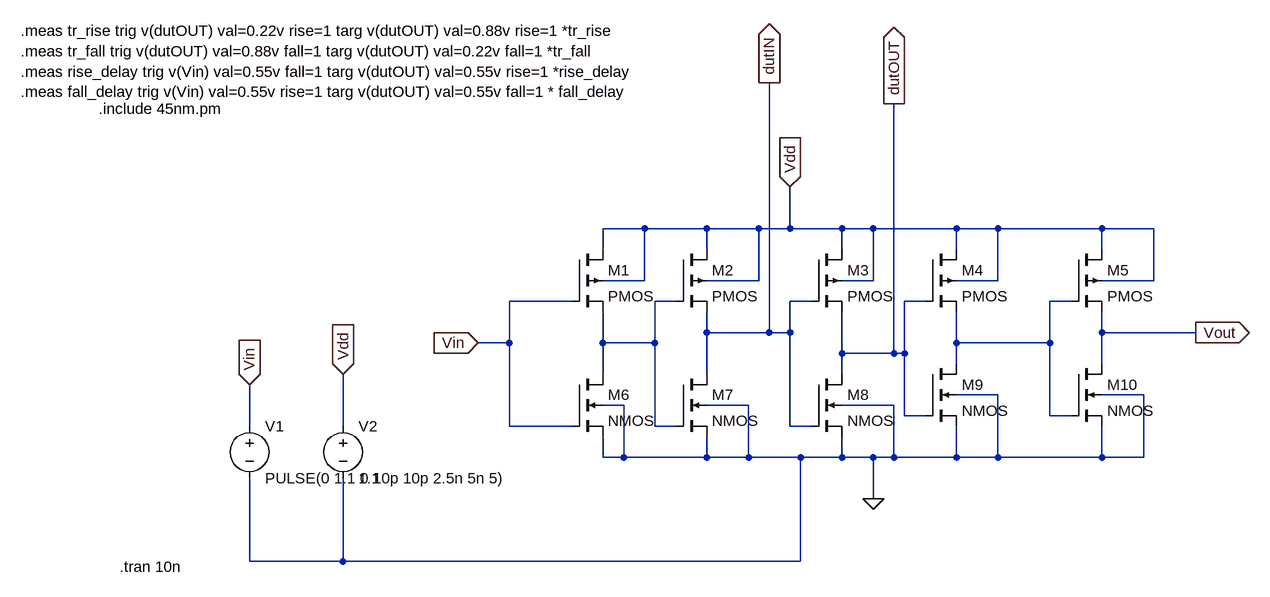
[diagram p0: schematic hw-1.asc]
hw-1.asc, the LTspice schematic file:
Version 4
SHEET 1 1280 732
WIRE 320 192 256 192
WIRE 416 192 320 192
WIRE 496 192 416 192
WIRE 544 192 544 128
WIRE 544 192 496 192
WIRE 624 192 544 192
WIRE 672 192 624 192
WIRE 800 192 672 192
WIRE 864 192 800 192
WIRE 1024 192 864 192
WIRE 1104 192 1024 192
WIRE 256 224 256 192
WIRE 416 224 416 192
WIRE 624 224 624 192
WIRE 800 224 800 192
WIRE 1024 224 1024 192
WIRE 320 272 320 192
WIRE 320 272 256 272
WIRE 496 272 496 192
WIRE 496 272 416 272
WIRE 672 272 672 192
WIRE 672 272 624 272
WIRE 864 272 864 192
WIRE 864 272 800 272
WIRE 1104 272 1104 192
WIRE 1104 272 1024 272
WIRE 208 304 112 304
WIRE 368 304 336 304
WIRE 576 304 544 304
WIRE 752 304 720 304
WIRE 976 304 944 304
WIRE 416 352 416 320
WIRE 512 352 512 -32
WIRE 512 352 416 352
WIRE 544 352 544 304
WIRE 544 352 512 352
WIRE 1024 352 1024 320
WIRE 1168 352 1024 352
WIRE 112 368 112 304
WIRE 112 368 64 368
WIRE 256 368 256 320
WIRE 336 368 336 304
WIRE 336 368 256 368
WIRE 800 368 800 320
WIRE 944 368 944 304
WIRE 944 368 800 368
WIRE 624 384 624 320
WIRE 704 384 704 0
WIRE 704 384 624 384
WIRE 720 384 720 304
WIRE 720 384 704 384
WIRE 800 400 800 368
WIRE 1024 400 1024 352
WIRE 256 416 256 368
WIRE 416 416 416 352
WIRE 624 416 624 384
WIRE 864 448 800 448
WIRE 1088 448 1024 448
WIRE 288 464 256 464
WIRE 480 464 416 464
WIRE 704 464 624 464
WIRE 720 480 720 384
WIRE 752 480 720 480
WIRE 944 480 944 368
WIRE 976 480 944 480
WIRE -288 496 -288 432
WIRE -144 496 -144 416
WIRE 112 496 112 368
WIRE 208 496 112 496
WIRE 336 496 336 368
WIRE 368 496 336 496
WIRE 544 496 544 352
WIRE 576 496 544 496
WIRE 256 544 256 512
WIRE 288 544 288 464
WIRE 288 544 256 544
WIRE 416 544 416 512
WIRE 416 544 288 544
WIRE 480 544 480 464
WIRE 480 544 416 544
WIRE 560 544 480 544
WIRE 624 544 624 512
WIRE 624 544 560 544
WIRE 672 544 624 544
WIRE 704 544 704 464
WIRE 704 544 672 544
WIRE 800 544 800 496
WIRE 800 544 704 544
WIRE 864 544 864 448
WIRE 864 544 800 544
WIRE 1024 544 1024 496
WIRE 1024 544 864 544
WIRE 1088 544 1088 448
WIRE 1088 544 1024 544
WIRE 672 608 672 544
WIRE -288 704 -288 576
WIRE -144 704 -144 576
WIRE -144 704 -288 704
WIRE 560 704 560 544
WIRE 560 704 -144 704
FLAG 544 128 Vdd
IOPIN 544 128 In
FLAG 64 368 Vin
IOPIN 64 368 In
FLAG 672 608 0
FLAG 1168 352 Vout
IOPIN 1168 352 Out
FLAG -288 432 Vin
IOPIN -288 432 In
FLAG -144 416 Vdd
IOPIN -144 416 In
FLAG 512 -32 dutIN
IOPIN 512 -32 Out
FLAG 704 0 dutOUT
IOPIN 704 0 Out
SYMBOL pmos4 208 224 R0
SYMATTR InstName M1
SYMATTR Value2 l=45n w=0.296u
SYMBOL pmos4 368 224 R0
SYMATTR InstName M2
SYMATTR Value2 l=45n w=0.296u m=4
SYMBOL pmos4 576 224 R0
SYMATTR InstName M3
SYMATTR Value2 l=45n w=0.296u m=16
SYMBOL pmos4 752 224 R0
SYMATTR InstName M4
SYMATTR Value2 l=45n w=0.296u m=64
SYMBOL pmos4 976 224 R0
SYMATTR InstName M5
SYMATTR Value2 l=45n w=0.296u m=256
SYMBOL nmos4 208 416 R0
SYMATTR InstName M6
SYMATTR Value2 l=45n w=0.2u
SYMBOL nmos4 368 416 R0
SYMATTR InstName M7
SYMATTR Value2 l=45n w=0.2u m=4
SYMBOL nmos4 576 416 R0
SYMATTR InstName M8
SYMATTR Value2 l=45n w=0.2u m=16
SYMBOL nmos4 752 400 R0
SYMATTR InstName M9
SYMATTR Value2 l=45n w=0.2u m=64
SYMBOL nmos4 976 400 R0
SYMATTR InstName M10
SYMATTR Value2 l=45n w=0.2u m=256
SYMBOL voltage -288 480 R0
WINDOW 123 0 0 Left 0
WINDOW 39 0 0 Left 0
SYMATTR InstName V1
SYMATTR Value PULSE(0 1.1 0 10p 10p 2.5n 5n 5)
SYMBOL voltage -144 480 R0
WINDOW 123 0 0 Left 0
WINDOW 39 0 0 Left 0
SYMATTR InstName V2
SYMATTR Value 1.1
TEXT -520 8 Left 2 !.include 45nm.pm
TEXT -640 -112 Left 2 !.meas tr_rise trig v(dutOUT) val=0.22v rise=1 targ v(dutOUT) val=0.88v rise=1 *tr_rise\n.meas tr_fall trig v(dutOUT) val=0.88v fall=1 targ v(dutOUT) val=0.22v fall=1 *tr_fall\n.meas rise_delay trig v(Vin) val=0.55v fall=1 targ v(dutOUT) val=0.55v rise=1 *rise_delay\n.meas fall_delay trig v(Vin) val=0.55v rise=1 targ v(dutOUT) val=0.55v fall=1 * fall_delay
TEXT -488 712 Left 2 !.tran 10n

The netlist it stands for:
* hw-1.asc
M1 Vdd Vin N001 Vdd PMOS l=45n w=0.296u
M2 Vdd N001 dutIN Vdd PMOS l=45n w=0.296u m=4
M3 Vdd dutIN dutOUT Vdd PMOS l=45n w=0.296u m=16
M4 Vdd dutOUT N002 Vdd PMOS l=45n w=0.296u m=64
M5 Vdd N002 Vout Vdd PMOS l=45n w=0.296u m=256
M6 N001 Vin 0 0 NMOS l=45n w=0.2u
M7 dutIN N001 0 0 NMOS l=45n w=0.2u m=4
M8 dutOUT dutIN 0 0 NMOS l=45n w=0.2u m=16
M9 N002 dutOUT 0 0 NMOS l=45n w=0.2u m=64
M10 Vout N002 0 0 NMOS l=45n w=0.2u m=256
V1 Vin 0 PULSE(0 1.1 0 10p 10p 2.5n 5n 5)
V2 Vdd 0 1.1
.model NMOS NMOS
.model PMOS PMOS
.lib standard.mos
.include 45nm.pm
.meas tr_rise trig v(dutOUT) val=0.22v rise=1 targ v(dutOUT) val=0.88v rise=1 *tr_rise
.meas tr_fall trig v(dutOUT) val=0.88v fall=1 targ v(dutOUT) val=0.22v fall=1 *tr_fall
.meas rise_delay trig v(Vin) val=0.55v fall=1 targ v(dutOUT) val=0.55v rise=1 *rise_delay
.meas fall_delay trig v(Vin) val=0.55v rise=1 targ v(dutOUT) val=0.55v fall=1 * fall_delay
.tran 10n
.backanno
.end